# EAGLE design stamp-fixed-mk-4.3 (EAGLE 6.5.0)
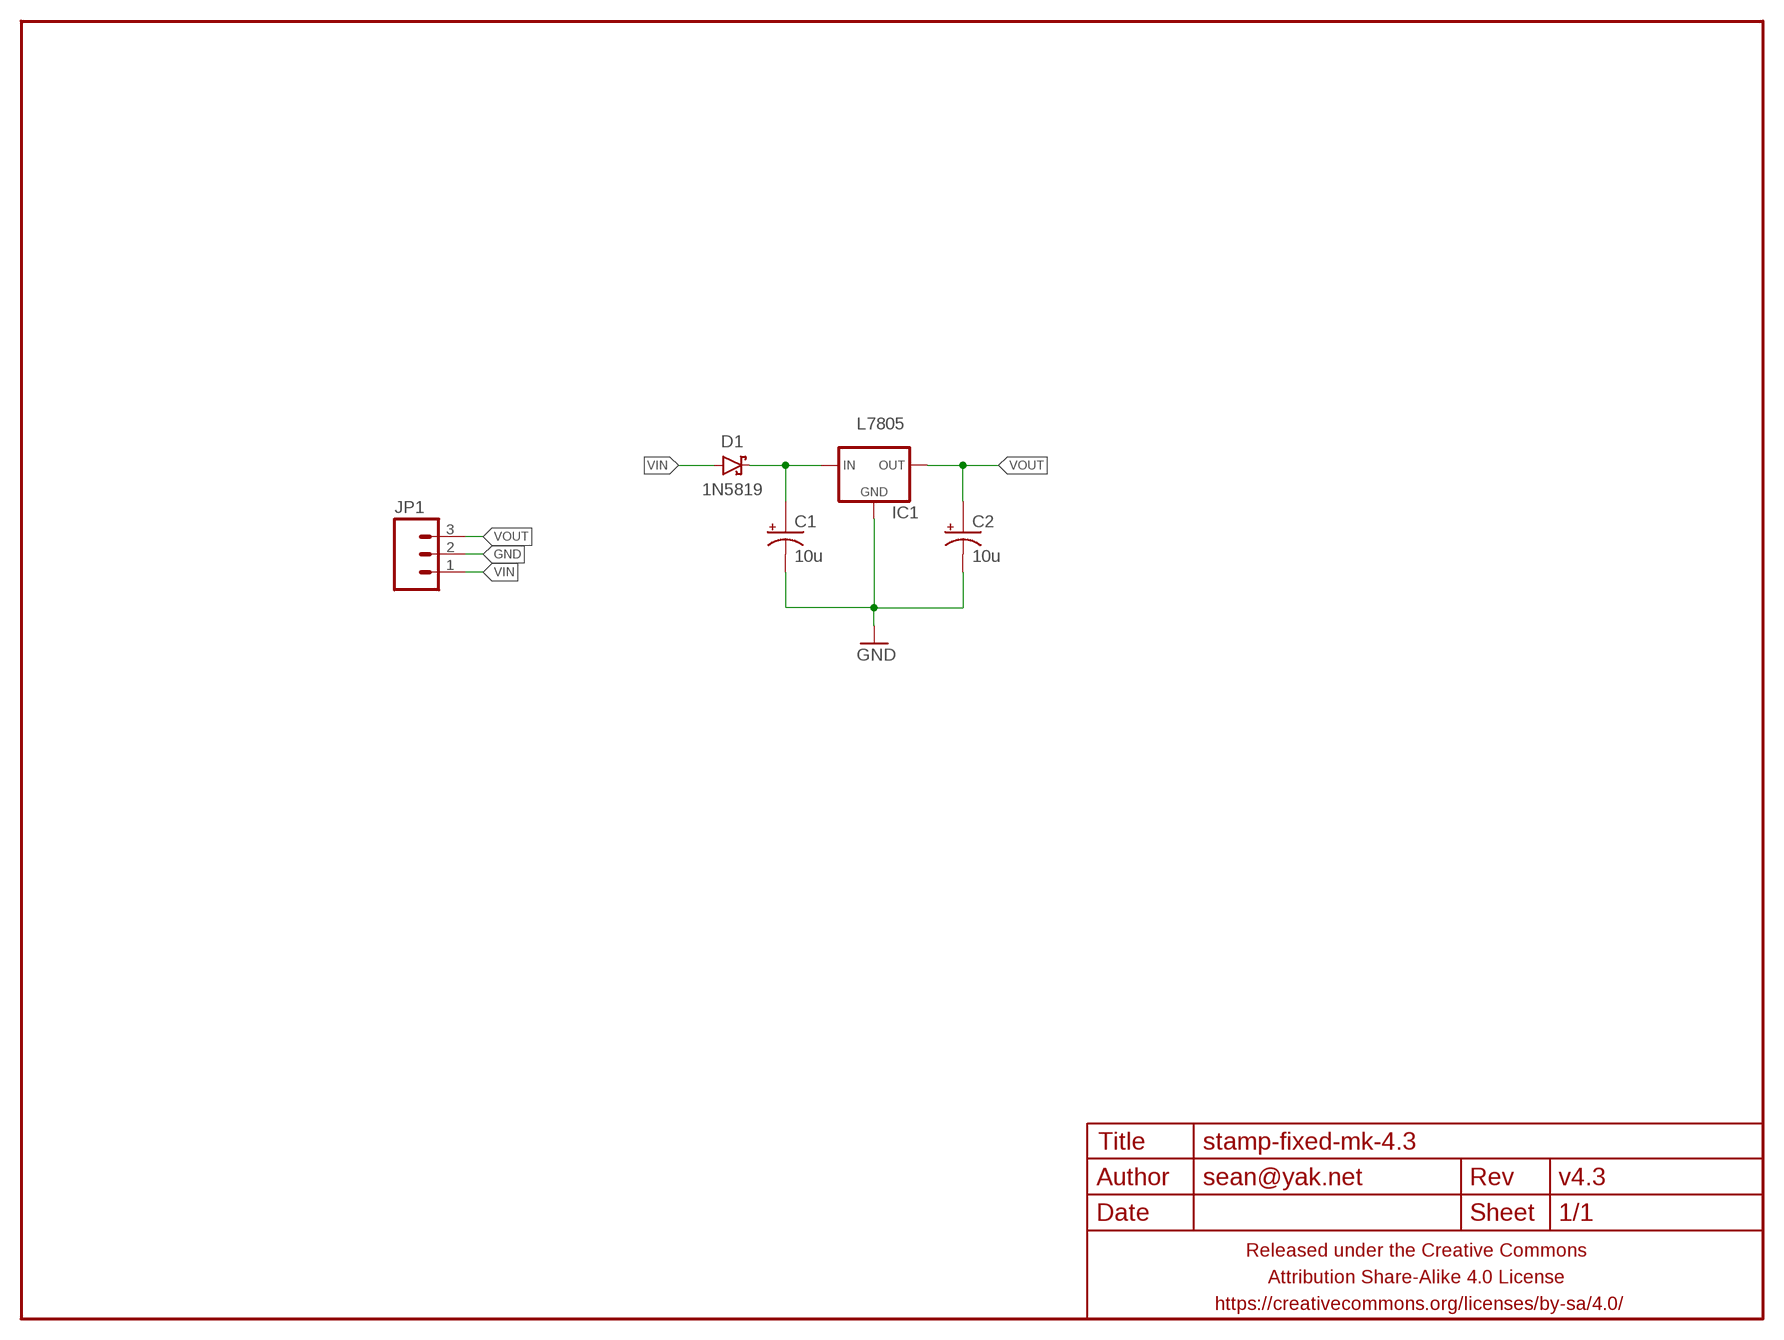
[diagram p0: schematic, sheet 1]

## Parts
C1  10u  CAPACITOR-POLARIZEDE2.5-5  [E2,5-5]
C2  10u  CAPACITOR-POLARIZEDE2.5-5  [E2,5-5]
D1  1N5819  DIODE-SCHOTTKYPTH-10.16MM  [DIODE-SCHOTTKY-10.16MM]
FRAME1  FRAME-LETTERNO_PACKAGE  [DUMMY]
IC1  L7805  V_REG_78XXTO-220-THERMPAD  [TO220-IGO-THERMPAD]
JP1  M03PTH-CENTERED  [1X03-CENTERED]

## Nets
GND: C1.- C2.- IC1.4(GND) IC1.GND JP1.2
N$2: C1.+ D1.C IC1.IN
VIN: D1.A JP1.1
VOUT: C2.+ IC1.OUT JP1.3

## Library data of the parts
C1 C2 = A_butts:CAPACITOR-POLARIZED: POLARIZED CAPACITOR, American symbol
D1 = A_butts:DIODE-SCHOTTKY: Schottky diodes in SFE's production catalog BAT20J 1A 23V 0.62Vf RB751 120mA 40V 0.37Vf PMEG4005EJ 0.5A 40V 0.42Vf MBRA140 1A 40V 0.5Vf B340A 3A 40V SMA
FRAME1 = A_butts:FRAME-LETTER: Schematic Frame Standard 8.5x11 US Letter frame; DESIGNER: sean@yak.net; VERSION: v4.3
IC1 = A_butts:V_REG_78XX: Voltage Regulator Standard 7805 5V regulator. IGO (Input Ground Output). Spark Fun Electronics SKU : COM-00107
JP1 = A_butts:M03: Header 3 Standard 3-pin 0.1" header. Use with straight break away headers (SKU : PRT-00116), right angle break away headers (PRT-00553), swiss pins (PRT-00743), machine pins (PRT-00117), and female headers (PRT-00115). Molex polarized connector foot print use with SKU : PRT-08232 with associated crimp pins and housings.

## Board
Postage Stamp Power Supply Small linear power supply with flexible layout.
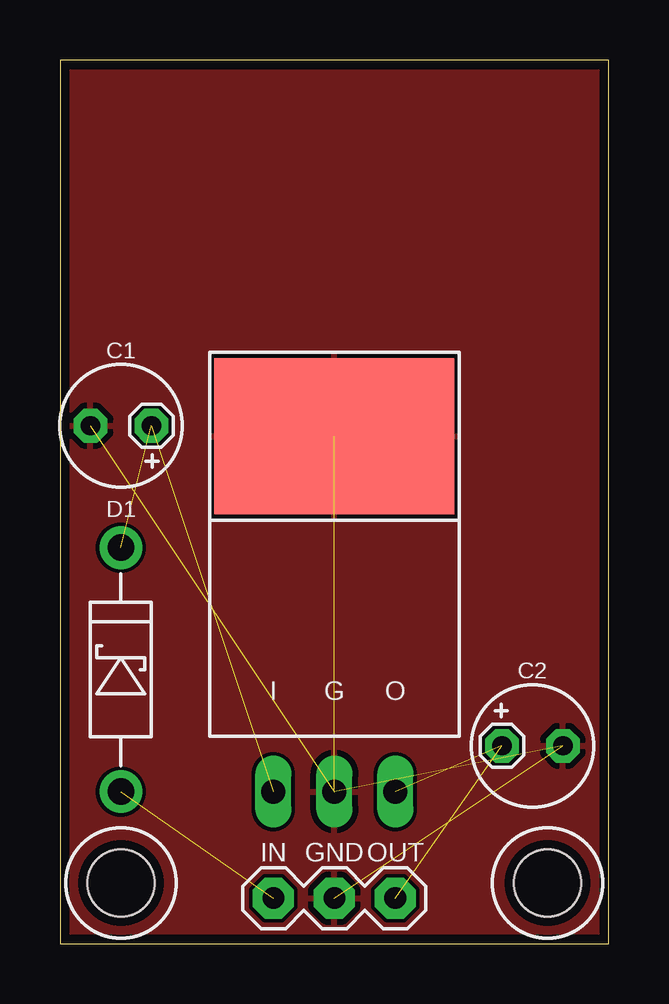
[diagram p1: board, top side]

Size 22.86 x 36.83 mm. Coordinates in mm from the lower left corner, seen from the top.
Outline: 22.86,0 22.86,36.83 0,36.83 0,0 22.86,0
Copper layers (1*16): Top 0.0356mm / dielectric 1.5011mm / Bottom 0.0356mm
Design rules "LaenPCBOrder *": minimum track width 6mil, minimum drill 13mil, track to track 6mil, track to pad 6mil, pad to pad 6mil, via to via 6mil, smd to smd 6mil, copper to edge 15mil, drill to drill 6mil, minimum pad ring 7mil, minimum via ring 7mil, stop-mask expansion 3mil, vias tented up to drill 20mil, thermal gap 10mil
Holes 2.8 mm at 2.54,2.54 20.32,2.54

### Footprints (pad centres in the part's own frame; a part is rotated, then mirrored left to right if it is on the bottom)
E2,5-5 = drill 0.8 pad 1.4 octagon: + -1.27,0; - 1.27,0
DIODE-SCHOTTKY-10.16MM = drill 1.1 pad 1.778: A -5.08,0; C 5.08,0
TO220-IGO-THERMPAD = smd 10 x 6.5: 4 0,11 | drill 1 long: GND 0,-3.81; IN -2.54,-3.81; OUT 2.54,-3.81
1X03-CENTERED = drill 0.9 pad 1.7 octagon: 1 -2.54,0; 2 0,0; 3 2.54,0

### Placement (x,y rotation side)
C1  2.54,21.59 180 top
C2  19.68,8.26 0 top
D1  2.54,11.43 90 top
FRAME1  0,-0.5 0 top
IC1  11.43,10.16 0 top
JP1  11.43,1.91 0 top

### Tracks (layer width: path | path; a pad name or v marks a point on that pad's centre or on a via)
GND  (4 unrouted)
  pour Top: 0,0 0,36.83 22.86,36.83 22.86,0
N$2  (2 unrouted)
VIN  (1 unrouted)
VOUT  (2 unrouted)

### Text on the board
tPlace: IN | GND | OUT